# EAGLE design osbee_3.0 (EAGLE 9.6.2)
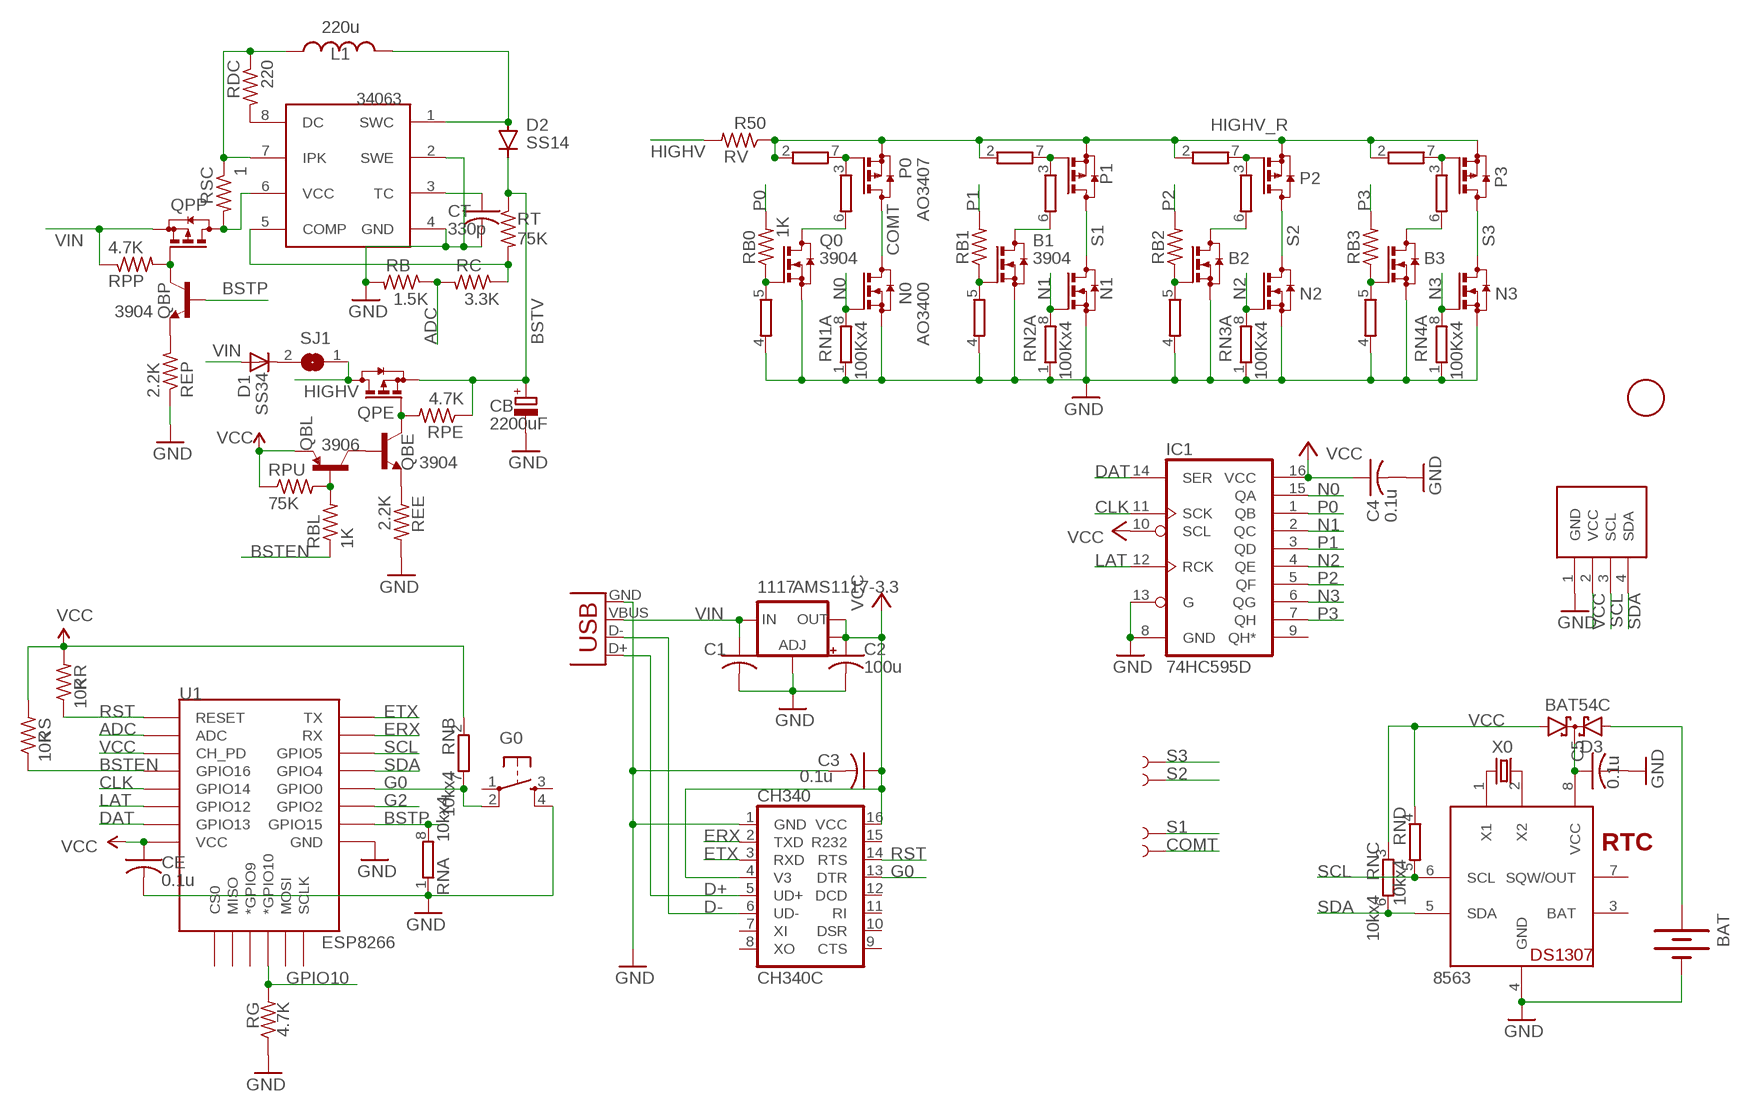
[diagram p0: schematic, sheet 1]

## Parts
1F  FIDUCIAL  [FIDUCIAL_1MM]
1117  AMS1117-3.3  V_REG_LM1117SOT223  [SOT223]
8563  PCF8563  DS1307SOIC  [SO08]
34063  MC34063  MC33063/MC34063D  [SO08]
B1  3904  BSS123  [SOT23]
B2  3904  BSS123  [SOT23]
B3  3904  BSS123  [SOT23]
BAT  BATTERYBATTERY_12MM_SMT  [BATTCON_12MM_SMT]
C1  10u  C-USC0805K  [C0805K]
C2  100u  CPOL-USC  [PANASONIC_C]
C3  0.1u  C-USC0603K  [C0603K]
C4  0.1u  C-USC0603  [C0603]
C5  0.1u  C-USC0603  [C0603]
CB  2200uF  CPOL-EUE5-8.5  [E5-8,5]
CE  0.1u  C-USC0603  [C0603]
CH340  CH340C  CH340G  [SO16]
CT  330p  C-USC0603K  [C0603K]
D1  SS34  DIODESMB  [SMB-DIODE]
D2  SS14  DIODE-DO-214AC  [DO-214AC]
D3  BAT54C  [SOT23]
G0  SPST_TACT  [EVQ-Q2-SMD]
IC1  74HC595D  74LS595D  [SO16]
L1  220u  INDUCTORCR54  [CR54]
N0  AO3400  BSS123  [SOT23]
N1  AO3400  BSS123  [SOT23]
N2  AO3400  BSS123  [SOT23]
N3  AO3400  BSS123  [SOT23]
P0  AO3407  BSS84  [SOT23]
P1  AO3407  BSS84  [SOT23]
P2  AO3407  BSS84  [SOT23]
P3  AO3407  BSS84  [SOT23]
Q0  3904  BSS123  [SOT23]
QBE  3904  TRANSISTOR_NPNSOT23-3  [SOT23-3]
QBL  3906  TRANSISTOR_PNPSMD  [SOT23-3]
QBP  3904  TRANSISTOR_NPNSOT23-3  [SOT23-3]
QPE  AO3407  BSS84  [SOT23]
QPP  AO3407  BSS84  [SOT23]
RB  1.5K  R-US_R0603  [R0603]
RB0  1K  R-US_R0603  [R0603]
RB1  1K  R-US_R0603  [R0603]
RB2  1K  R-US_R0603  [R0603]
RB3  1K  R-US_R0603  [R0603]
RBL  1K  R-US_R0603  [R0603]
RC  3.3K  R-US_R0603  [R0603]
RDC  220  R-US_R0603  [R0603]
REE  2.2K  R-US_R0603  [R0603]
REP  2.2K  R-US_R0603  [R0603]
RG  4.7K  R-US_R0603  [R0603]
RN  10kx4  4R-NEXB38V  [EXB38V]
RN1  100Kx4  4R-NEXB38V  [EXB38V]
RN2  100Kx4  4R-NEXB38V  [EXB38V]
RN3  100Kx4  4R-NEXB38V  [EXB38V]
RN4  100Kx4  4R-NEXB38V  [EXB38V]
RPE  4.7K  R-US_R0603  [R0603]
RPP  4.7K  R-US_R0603  [R0603]
RPU  75K  R-US_R0603  [R0603]
RR  10K  R-US_R0603  [R0603]
RS  10K  R-US_R0603  [R0603]
RSC  1  R-US_R0603  [R0603]
RT  75K  R-US_R0603  [R0603]
RV  R50  R-US_R2512  [R2512]
SJ1  SJ  [SJ]
ST1  NOBOM-  SEWTAP9X9  [PETAL-9X9]
ST2  NOBOM-  SEWTAP9X9  [PETAL-9X9]
ST3  NOBOM-  SEWTAP9X9  [PETAL-9X9]
STT  NOBOM-  SEWTAP9X9  [PETAL-9X9]
U1  ESP8266  ESP12ESMD  [ESP12E-SMD]
U$1  NOBOM-OLED  SSD1306_OLED_I2C0.75BNEW  [SSD1306_OLED_I2C_PCB_0.75_BNEW]
USB  USBMICROB2  [USB-MICROB2]
X0  32.768kHz  KX-327-NHT  [3.2X1.5]

## Nets
ADC: RB.1 RC.2 U1.ADC
BSTEN: RBL.1 RS.1 U1.GPIO16
BSTP: QBP.1(B) RN.8 U1.GPIO15
BSTV [relaypower]: CB.+ D2.C QPE.2(S) RPE.1 RT.1
CLK: IC1.11(SCK) U1.GPIO14
COMT [relaypower]: N0.3(D) P0.3(D) STT.P$1
D+: CH340.5(UD+) USB.D+
D-: CH340.6(UD-) USB.D-
DAT: IC1.14(SER) U1.GPIO13
ERX: CH340.2(TXD) U1.RXD0(RX)
ETX: CH340.3(RXD) U1.TXD0(TX)
G0: CH340.13(DTR) G0.2 RN.7 U1.GPIO0
G2: U1.GPIO2
GND: 1117.1(ADJ) 8563.4(GND) 34063.2(SWE) 34063.4(GND) B1.2(S) B2.2(S) B3.2(S) BAT.P$1(-) C1.2 C2.- C3.2 C4.2 C5.2 CB.- CE.2 CH340.1(GND) CT.2 G0.4 IC1.8(GND) IC1.13(G) N0.2(S) N1.2(S) N2.2(S) N3.2(S) Q0.2(S) RB.2 REE.2 REP.1 RG.1 RN1.1 RN1.4 RN2.1 RN2.4 RN3.1 RN3.4 RN4.1 RN4.4 RN.1 U1.GND U$1.1(GND) USB.GND
GPIO10: RG.2 U1.GPIO10(*GPIO10)
HIGHV [relaypower]: QPE.3(D) RV.2 SJ1.1
HIGHV_R [relaypower]: P0.2(S) P1.2(S) P2.2(S) P3.2(S) RN1.2 RN2.2 RN3.2 RN4.2 RV.1
LAT: IC1.12(RCK) U1.GPIO12
N0: IC1.15(QA) N0.1(G) RN1.8
N1: IC1.2(QC) N1.1(G) RN2.8
N2: IC1.4(QE) N2.1(G) RN3.8
N3: IC1.6(QG) N3.1(G) RN4.8
N$1: P0.1(G) RN1.3 RN1.7
N$2: QBP.3(C) QPP.1(G) RPP.2
N$3: Q0.3(D) RN1.6
N$4: B1.3(D) RN2.6
N$5: Q0.1(G) RB0.1 RN1.5
N$6: B3.1(G) RB3.1 RN4.5
N$7: P1.1(G) RN2.3 RN2.7
N$8: B3.3(D) RN4.6
N$9 [relaypower]: 34063.1(SWC) D2.A L1.P$2
N$10: D1.C SJ1.2
N$11: BAT.P$2(+) D3.2(A2)
N$12: P2.1(G) RN3.3 RN3.7
N$13: B2.3(D) RN3.6
N$14: 8563.1(X1) X0.1
N$15: QBL.1(B) RBL.2 RPU.2
N$16: P3.1(G) RN4.3 RN4.7
N$17: QBE.1(B) QBL.3(C)
N$21: QBE.2(E) REE.1
N$23: B1.1(G) RB1.1 RN2.5
N$24: B2.1(G) RB2.1 RN3.5
N$26 [relaypower]: 34063.7(IPK) L1.P$1 RDC.1 RSC.1
N$27: 34063.6(VCC) QPP.3(D) RSC.2
N$28: 34063.3(TC) CT.1
N$29: 34063.5(COMP) RC.1 RT.2
N$30: 8563.2(X2) X0.2
N$31: 34063.8(DC) RDC.2
N$32: QBP.2(E) REP.2
N$38: QBE.3(C) QPE.1(G) RPE.2
N$51: 8563.8(VCC) C5.1 D3.3(CC)
P0: IC1.1(QB) RB0.2
P1: IC1.3(QD) RB1.2
P2: IC1.5(QF) RB2.2
P3: IC1.7(QH) RB3.2
RST: CH340.14(RTS) RR.1 U1.RESET
S1 [relaypower]: N1.3(D) P1.3(D) ST1.P$1
S2 [relaypower]: N2.3(D) P2.3(D) ST2.P$1
S3 [relaypower]: N3.3(D) P3.3(D) ST3.P$1
SCL: 8563.6(SCL) RN.5 U1.GPIO5 U$1.3(SCL)
SDA: 8563.5(SDA) RN.6 U1.GPIO4 U$1.4(SDA)
VCC [power]: 1117.2(OUT) 1117.4(OUT) C2.+ C3.1 C4.1 CE.1 CH340.4(V3) CH340.16(VCC) D3.1(A1) IC1.10(SCL) IC1.16(VCC) QBL.2(E) RN.2 RN.3 RN.4 RPU.1 RR.2 RS.2 U1.CH_PD U1.VCC U$1.2(VCC)
VIN [power]: 1117.3(IN) C1.1 D1.A QPP.2(S) RPP.1 USB.VBUS
Unconnected: 8563.7(SQW/OUT) CH340.7(XI) CH340.8(XO) CH340.9(CTS) CH340.10(DSR) CH340.11(RI) CH340.12(DCD) CH340.15(R232) G0.1 G0.3 IC1.9(QH*) U1.CS0 U1.GPIO9(*GPIO9) U1.MISO U1.MOSI U1.SCLK

## Notes on the sheet
- RTC

## Power pins joined to a net without a drawn wire
BAT: 8563.3(BAT)

## Library data of the parts
1F = adafruitGood:FIDUCIAL: For use by pick and place machines to calibrate the vision/machine, 1mm By microbuilder.eu
1117 = SparkFun:V_REG_LM1117: Voltage Regulator LM1117 Standard adjustable voltage regulator but in SMD form. Spark Fun Electronics SKU : COM-00595
8563 = adafruit:DS1307: DS1307 Real time clock (RTC) with battery backup ability. Talk to it via i2c
34063 = adafruit:MC33063/MC34063: MC33063 and MC34063 Basic DC/DC converter with internal power-NPN transistor, 100KHz, 1.5A peak switch current. 3-40 input/output.
B1-B3 N0 N1-N3 Q0 = transistor-small-signal:BSS123: N-CHANNEL MOS FET
BAT = SparkFunNew:BATTERY: Battery Holders Various common sizes : AA, AAA, 20mm coin cell and 12mm coin cell.
C1 C3-C5 CE CT = adafruit:C-US: CAPACITOR, American symbol
C2 = adafruit_3:CPOL-US: POLARIZED CAPACITOR, American symbol
CB = rcl:CPOL-EU: POLARIZED CAPACITOR, European symbol; SPICEPREFIX: C
CH340 = SparkFunNew:CH340
D1 = SparkFunNew:DIODE: Diode These are standard reverse protection diodes and small signal diodes. SMA package can handle up to about 1A. SOD-323 can handle about 200mA. What the SOD-323 package when ordering, there are some mfgs out there that are 5-pin packages.
D2 = diode:DIODE-: DIODE
D3 = diode:BAT54C: Schottky Diodes Source: Fairchild .. BAT54.pdf
G0 = adafruit_3:SPST_TACT: SMT 6mm switch, EVQQ2 series http://www.ladyada.net/library/eagle
IC1 = SparkFun:74*595: 8-bit SHIFT REGISTER, output latch
L1 = SparkFunNew:INDUCTOR: Inductors Basic Inductor/Choke - 0603 and 1206. Footprints are not proven and vary greatly between part numbers.
P0 P1-P3 QPE QPP = transistor-small-signal:BSS84: P-CHANNEL MOS FET
QBE QBP = SparkFunNew:TRANSISTOR_NPN: Transistor NPN BJT configuration in SOT23 package. MMBT2222 is the common NPN we use. Double check BCE configuration again layout.
QBL = SparkFun:TRANSISTOR_PNP
RB RB0 RB1-RB3 RBL RC RDC REE REP RPE RPP RPU RSC RT = adafruitGood:R-US_: RESISTOR, American symbol
RG RV = adafruit2013:R-US_: RESISTOR, American symbol
RN RN1-RN4 = resistor-net:4R-N: Array Chip Resistor Source: RS Component / Phycomp; OC_FARNELL: unknown; OC_NEWARK: unknown
RR RS = adafruit:R-US_: RESISTOR, American symbol
SJ1 = jumper:SJ: SMD solder JUMPER
ST1-ST3 STT = LilyPad-Wearables:SEWTAP
U1 = esp8266modules:ESP12E: ESP12E Module
U$1 = adafruit2013:SSD1306_OLED_I2C
USB = SparkFunNew:USB: USB Connectors USB-B-PTH is fully proven SKU : PRT-00139 USB-miniB is fully proven SKU : PRT-00587 USB-A-PCB is untested. USB-A-H is throughly reviewed, but untested. Spark Fun Electronics SKU : PRT-00437 USB-B-SMT is throughly reviewed, but untested. Needs silkscreen touching up. USB-A-S has not been used/tested USB-MB-H has not been used/tested
X0 = crystal-geyer_V1_0:KX-327: Tuning Fork Crystals (kHz) SMD: KX327 - Serie Model Size l/w/h [mm] Frequency Range Frequency Stability Temp. Range [°C] Load Capacitance AECQ 200 availabel Datasheet KX-327VT KX-327FT KX-327RT KX-327NHT KX-327NHF KX-327L KX-327S 1.25/1.05/0.5 1.6/1.0/0.5 2.0/1.2/0.6 3.2/1.5/0.8 3.2/1.5/0.8 7.0/1.5/1.4 8.2/3.8/2.5 32,768 kHz 32,768 kHz 32,768 kHz 32,768 kHz 32,768 kHz 32,768 kHz 32,768 kHz ±10 … ±20ppm ±10 … ±20ppm ±10 … ±20ppm ±10 … ±20ppm ±10 … ±20ppm ±10 … ±20ppm ±5 … ±20ppm (*) -40°C …+85°C (*) -40°C …+85°C (*) -40°C …+85°C (*) -40°C …+85°C (*) -40°C …+125°C (*) -40°C …+85°C (*) -40°C …+85°C 7/9/12,5 7/9/12,5 7/9/12,6 7/9/12,5 9/12,5 7/9/12,5 6/12,5 - - - - yes - - KX-327VT.pdf <http://www.geyer-electronic.de/uploads/tx_userartikelfrequenz/GEYER-KX-327VT.pdf> KX-327FT.pdf <http://www.geyer-electronic.de/uploads/tx_userartikelfrequenz/GEYER-KX-327FT.pdf> KX-327RT.pdf <http://www.geyer-electronic.de/uploads/tx_userartikelfrequenz/GEYER-KX-327RT.pdf> KX-327NHT.pdf <http://www.geyer-electronic.de/uploads/tx_userartikelfrequenz/GEYER-KX-327NHT.pdf> KX-327NHF.pdf <http://www.geyer-electronic.de/uploads/tx_userartikelfrequenz/GEYER-KX-327NHF.pdf> KX-327L.pdf <http://www.geyer-electronic.de/uploads/tx_userartikelfrequenz/GEYER-KX-327L.pdf> KX-327S.pdf <http://www.geyer-electronic.de/uploads/tx_userartikelfrequenz/GEYER-KX-327S.pdf> <http://www.geyer-electronic.de/fileadmin/template/img/logo-geyer-electronic.png> Details see: http://www.geyer-electronic.de/Frequenz-Produkte.9.0.html Created 2016-06-07, Hans Locher 2016 (C) Geyer Quartz Technology KX327VT,KX327FT,KX327RT,KX327NHT,KX327NHF,KX327S,KX327L;125105;1610;2012;3215;7015;8238;1,25x1,05,1.25x1.05;1,6x1,0,1.6x1.0;2,0x1,2,2.0x1.2;3,2x1,5,3.2x1.5;8,2x3,8,8.2x3.8,7.0x1.5,7,0x1,532.768kHz

## Net classes
0 default: width 0.203 mm, clearance 0.178 mm
1 power: width 0.305 mm, clearance 0.178 mm
2 relaypower: width 0.406 mm, clearance 0.203 mm

## Board
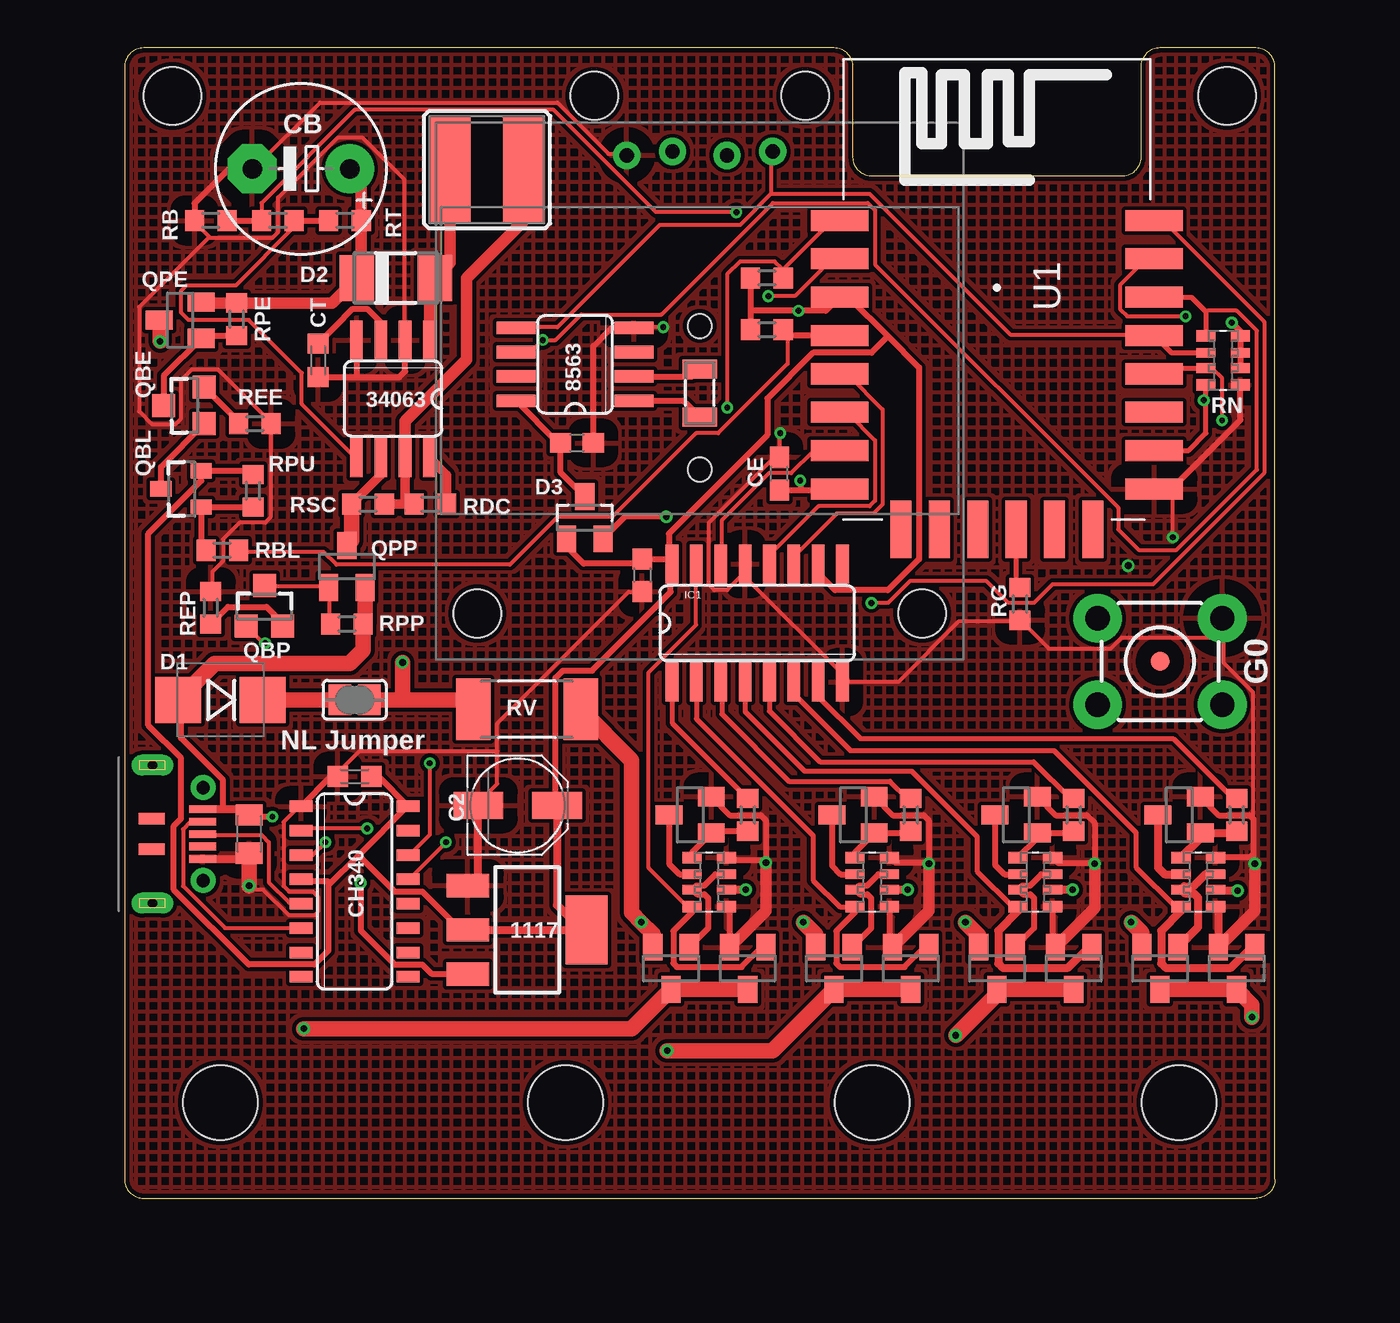
[diagram p1: board, top side]
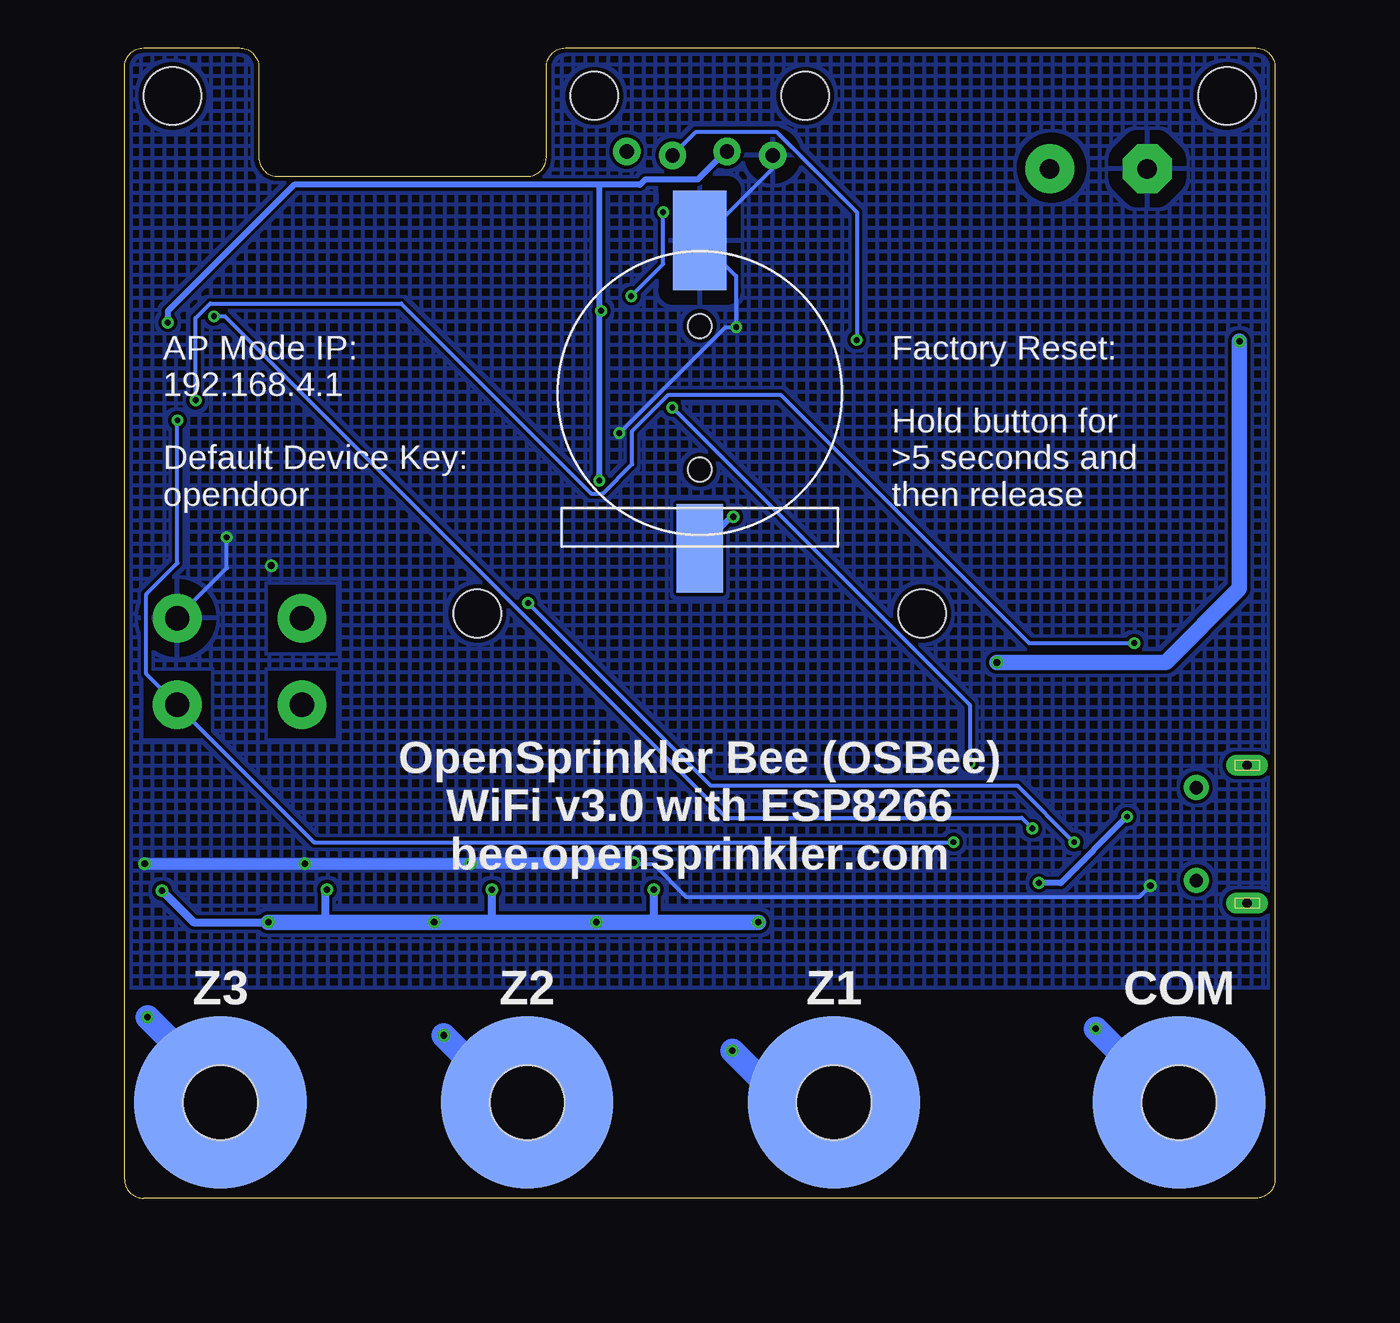
[diagram p2: board, bottom side, seen from below]

Size 60 x 60 mm. Coordinates in mm from the lower left corner, seen from the top.
Outline: 1,0 59,0 arc90 60,1 60,59 arc90 59,60 54,60 arc90 53,59 53,54.3 arc-90 52,53.3 39,53.3 arc-90 38,54.3 38,59 arc90 37,60 1,60 arc90 0,59 0,1 arc90 1,0
Copper layers (1*16): Top 0.035mm / dielectric 1.5mm / Bottom 0.035mm
Design rules "Fusion_eagle_rule_v1.1 *": minimum track width 6mil, minimum drill 12mil, track to track 6mil, track to pad 6mil, pad to pad 6mil, via to via 6mil, smd to smd 0mil, copper to edge 10mil, drill to drill 10mil, minimum pad ring 10mil, minimum via ring 6mil, stop-mask expansion 2mil, vias tented up to drill 100mil, thermal gap 30mil
Holes 3 mm at 2.5,57.5 57.5,57.5
Holes 3.9 mm at 5,5 23,5 39,5 55,5
bRestrict: area 9.8,51.9 to 13.5,55.6; area 49,28.5 to 52.5,32; area 49,24 to 52.5,27.5; area 55.5,24 to 59,27.5
vRestrict: area 39,36.5 to 52,52.5

### Footprints (pad centres in the part's own frame; a part is rotated, then mirrored left to right if it is on the bottom)
FIDUCIAL_1MM = smd 1 x 1: 1 0,0
SOT223 = smd 2.235 x 1.219: 1 3.099,-2.311; 2 3.099,0; 3 3.099,2.311 | smd 2.2 x 3.6: 4 -3.099,0
SO08 = smd 0.66 x 2.032: 1 -1.905,-3.073; 2 -0.635,-3.073; 3 0.635,-3.073; 4 1.905,-3.073; 5 1.905,3.073; 6 0.635,3.073; 7 -0.635,3.073; 8 -1.905,3.073
SOT23 = smd 1 x 1.4: 1 -0.95,-1.1; 2 0.95,-1.1; 3 0,1.1
BATTCON_12MM_SMT = smd 2.8 x 5.2: P$1 0,11.96 | smd 2.4 x 4.6: P$2 0,-4.1 | hole 1.25: 0,7.5; 0,0
C0805K = smd 1.1 x 1.4: 1 -1,0; 2 1,0
PANASONIC_C = smd 2.6 x 1.4: + 2.05,0; - -2.05,0
C0603K = smd 1.05 x 1.08: 1 -0.875,0; 2 0.875,0
C0603 = smd 1.1 x 1: 1 -0.85,0; 2 0.85,0
E5-8,5 = drill 1.016 pad 2.54: + -2.54,0 | drill 1.016 pad 2.54 octagon: - 2.54,0
SO16 = smd 0.6 x 1.2: 1 -4.445,-2.8; 2 -3.175,-2.8; 3 -1.905,-2.8; 4 -0.635,-2.8; 5 0.635,-2.8; 6 1.905,-2.8; 7 3.175,-2.8; 8 4.445,-2.8; 9 4.445,2.8; 10 3.175,2.8; 11 1.905,2.8; 12 0.635,2.8; 13 -0.635,2.8; 14 -1.905,2.8; 15 -3.175,2.8; 16 -4.445,2.8
SMB-DIODE = smd 2.4 x 2.4: A 2.2,0; C -2.2,0
DO-214AC = smd 1.8 x 2.4: A 2.025,0; C -2.025,0
EVQ-Q2-SMD = drill 1.27 pad 2.54: 1 -3.251,-2.261; 2 3.251,-2.261; 3 -3.251,2.261; 4 3.251,2.261
SO16' = smd 0.66 x 2.032: 1 -4.445,-3.073; 2 -3.175,-3.073; 3 -1.905,-3.073; 4 -0.635,-3.073; 5 0.635,-3.073; 6 1.905,-3.073; 7 3.175,-3.073; 8 4.445,-3.073; 9 4.445,3.073; 10 3.175,3.073; 11 1.905,3.073; 12 0.635,3.073; 13 -0.635,3.073; 14 -1.905,3.073; 15 -3.175,3.073; 16 -4.445,3.073
CR54 = smd 2.15 x 5.5: P$1 -1.92,0; P$2 1.92,0
SOT23-3 = smd 1.2 x 1.2: 1 1,-0.95; 2 1,0.95; 3 -1.1,0
SOT23-3' = smd 0.8 x 1.1: 1 -0.95,-1; 2 0.95,-1; 3 0,1.1
R0603 = smd 1 x 1.1: 1 -0.85,0; 2 0.85,0
EXB38V = smd 0.6 x 1: 1 -1.275,-0.9; 4 1.275,-0.9; 5 1.275,0.9; 8 -1.275,0.9 | smd 0.5 x 1: 2 -0.4,-0.9; 3 0.4,-0.9; 6 0.4,0.9; 7 -0.4,0.9
R2512 = smd 1.8 x 3.2: 1 -2.8,0; 2 2.8,0
SJ = smd 1.168 x 1.6: 1 -0.762,0; 2 0.762,0
PETAL-9X9 = smd 9 x 9: P$1 0,0
ESP12E-SMD = smd 1.1 x 3: ADC -1.5,-8.2; CH_PD 0.5,-8.2; GND 10.5,8.2; GPIO0 4.5,8.2; GPIO2 6.5,8.2; GPIO4 2.5,8.2; GPIO5 0.5,8.2; GPIO12 6.5,-8.2; GPIO13 8.5,-8.2; GPIO14 4.5,-8.2; GPIO15 8.5,8.2; GPIO16 2.5,-8.2; RESET -3.5,-8.2; RXD0 -1.5,8.2; TXD0 -3.5,8.2; VCC 10.5,-8.2 | smd 3 x 1.1: CS0 12.6,-5; GPIO9 12.6,-1; GPIO10 12.6,1; MISO 12.6,-3; MOSI 12.6,3; SCLK 12.6,5
SSD1306_OLED_I2C_PCB_0.75_BNEW = drill 0.75 pad 1.422: 1 -3.81,-0.1; 2 -1.42,0.1; 3 1.42,-0.1; 4 3.81,0.1 | hole 2.5: 11.6,-24; -11.6,-24; -5.5,3; 5.5,3
USB-MICROB2 = smd 1.4 x 0.4: D+ -1.375,0; D- -1.375,-0.65; GND -1.375,1.3; ID -1.375,0.65; VBUS -1.375,-1.3 | drill 0.5 pad 1.1 long: MT1 1.25,-3.6; MT2 1.25,3.6 | smd 1.35 x 0.6: MT3 1.275,0.8; MT4 1.275,-0.8 | drill 0.7 pad 1.3: MT5 -1.4,-2.425; MT6 -1.4,2.425
3.2X1.5 = smd 1 x 1.8: 1 -1.25,0; 2 1.25,0

### Placement (x,y rotation side)
1F  54,28 0 top
1117  21,14 180 top
8563  23.5,43.5 90 top
34063  14,41.7 180 top
B1  38,20 90 top
B2  46.5,20 90 top
B3  55,20 90 top
BAT  30,38 0 bottom
C1  6.5,19 270 top
C2  20.5,20.5 0 top
C3  12,22 180 top
C4  27,32.5 270 top
C5  23.6,39.4 0 top
CB  9.2,53.7 180 top
CE  34.15,37.8 90 top
CH340  12,16 270 top
CT  10.1,43.7 270 top
D1  5,26 180 top
D2  14.15,48 0 top
D3  24,35.5 0 top
G0  54,28 0 top
IC1  74HC595D  [SO16']  33,30 0 top
L1  18.9,53.65 180 top
N0  32.5,12 180 top
N1  41,12 180 top
N2  49.5,12 180 top
N3  58,12 180 top
P0  28.5,12 180 top
P1  37,12 180 top
P2  45.5,12 180 top
P3  54,12 180 top
Q0  29.5,20 90 top
QBE  3.15,41.35 0 top
QBL  3906  [SOT23-3']  3,37 90 top
QBP  7.3,30.85 270 top
QPE  2.9,45.8 90 top
QPP  11.6,32.95 0 top
RB  4.5,51 180 top
RB0  32.5,20 90 top
RB1  41,20 90 top
RB2  49.5,20 90 top
RB3  58,20 90 top
RBL  5.1,33.8 180 top
RC  8,51 180 top
RDC  15.95,36.2 0 top
REE  6.8,40.4 0 top
REP  4.5,30.8 270 top
RG  46.7,31 90 top
RN  57.3,43.7 90 top
RN1  30.5,16.5 90 top
RN2  39,16.5 90 top
RN3  47.5,16.5 90 top
RN4  56,16.5 90 top
RPE  5.85,45.85 270 top
RPP  11.6,29.95 180 top
RPU  6.7,36.9 270 top
RR  33.5,48 180 top
RS  33.5,45.3 180 top
RSC  12.7,36.2 180 top
RT  11.5,51 180 top
RV  21,25.5 180 top
SJ1  12,26 180 top
ST1  23,5 0 bottom
ST2  39,5 0 bottom
ST3  55,5 0 bottom
STT  5,5 0 bottom
U1  45.5,47.5 270 top
U$1  30,54.5 0 top
USB  2.7,19 180 top
X0  30,42 90 top

### Tracks (layer width: path | path; a pad name or v marks a point on that pad's centre or on a via)
ADC  (via drill 0.3)
  Top 0.203: v31.91,51.44 27.72,51.44 22.38,56.77 12,56.77 7.14,51.91 7.14,51.15 RC.2 | v33.58,47.06 34.96,47.06 36.86,48.96 37.24,48.96 U1.ADC
  Top 0.305: RB.1 RC.2
  Bottom 0.203: v31.91,51.44 31.91,48.73 v33.58,47.06
BSTEN
  Top 0.203: RBL.1 6,33.72 10.38,33.72 11.05,33.05 20.1,33.05 22.57,35.53 25.43,35.53 29.81,39.91 30.96,39.91 34.58,43.53 34.58,44.86 RS.1
  Top 0.305: U1.GPIO16 34.65,45 RS.1
BSTP  (via drill 0.3)
  Top 0.203: v7.33,28.96 7.24,28.96 6.38,29.81 QBP.1 | v56.29,41.62 56.4,41.62
  Top 0.254: U1.GPIO15 55.5,39 56.4,39.9 56.4,41.62 RN.8
  Bottom 0.203: v7.33,28.96 12.82,28.96 25.78,41.91 31.62,41.91 33.53,40.01 33.53,38.29 35.05,36.77 35.66,36.77 45.56,46.67 55.53,46.67 56.29,45.91 v56.29,41.62
BSTV
  Top 0.61: CB.+ 12.35,53.09 RT.1 12.35,48.23 D2.C 10.82,46.7 RPE.1 4.05,46.7 QPE.2
CLK
  Top 0.203: IC1.11 34.96,33.15 34.96,33.53 37.15,35.72 39.05,35.72 39.53,36.2 39.53,41.15 37.72,42.96 37.34,42.96 U1.GPIO14
COMT  (via drill 0.35)
  Top 0.813: N0.3 P0.3 26.45,8.85 v9.35,8.85
  Bottom 1.27: STT.P$1 5.5,5 v9.35,8.85
D+
  Top 0.203: CH340.5 9.14,15.43 8.57,15.43 7.53,16.48 7.53,18.57 7.14,18.95 4.1,18.95 USB.D+
D-
  Top 0.203: CH340.6 9.14,14.1 5.24,14.1 3.05,16.29 3.05,19.24 3.43,19.62 4,19.62 USB.D-
DAT
  Top 0.203: IC1.14 31.15,33.15 31.15,35.34 33.62,37.81 34.77,37.81 35.91,38.96 37.24,38.96 U1.GPIO13
ERX  (via drill 0.3)
  Top 0.203: v12.65,19.29 9.27,19.29 CH340.2 | v55.34,46.01 52.29,46.01 51.91,46.39 51.91,47.62 53.24,48.96 53.63,48.96 U1.RXD0
  Bottom 0.203: v12.65,19.29 13.2,19.84 28.6,19.84 54.77,46.01 v55.34,46.01
ETX  (via drill 0.3)
  Top 0.203: v10.48,18.57 9.81,17.91 9.24,17.91 CH340.3 | v38.96,31.05 39.81,31.05 40.96,32.19 44.96,32.19 46.1,31.05 47.44,31.05 48.42,32.03 53.65,32.03 59.44,37.81 59.44,45.72 54.2,50.96 53.72,50.96 U1.TXD0
  Bottom 0.203: v10.48,18.57 13.43,21.53 29.43,21.53 v38.96,31.05
G0  (via drill 0.3)
  Top 0.203: v16.76,18.57 14.86,16.67 CH340.13 | v57.24,40.58 57.24,42.77 56.77,43.24 56.48,43.24 RN.7
  Top 0.254: U1.GPIO0 54,43.3 RN.7
  Bottom 0.203: v16.76,18.57 50.1,18.57 57.24,25.72 G0.2 57.34,25.81 58.86,27.34 58.86,31.51 57.24,33.13 v57.24,40.58
GND  (via drill 0.3, 0.35)
  Top 0.203: v28.1,45.43 26.67,45.43 8563.4 | REP.1 4.57,31.72 4.57,32.67 5.14,33.24 5.14,34.38 6,35.24 7.33,35.24 7.62,35.53 7.62,40.39 REE.2 7.62,40.48 4.86,43.24 3.52,43.24 2.95,42.67 2.95,40.67 2.67,40.39 1.43,40.39 0.76,41.05 0.76,46.48 4.38,50.1 4.48,50.1 | 4.48,50.1 7.71,50.1 8,50.39 8,52.2 11.14,55.34 12.38,55.34 14.57,53.15 14.57,44.86 34063.2 | 4.48,50.1 3.71,50.86 RB.2 | U$1.1 26.1,54.48 25.24,54.48 22.57,57.15 10.19,57.15 6.76,53.72 CB.- | 19.43,23.31 19.43,21.62 18.48,20.67 C2.- | 19.43,23.31 19.43,24.77 26.29,31.62 26.96,31.62 C4.2 | C3.2 11.12,22.2 12.24,23.31 19.43,23.31 | v6.5,16.3 6.86,16.1 7.24,16.1 8.57,14.76 9.91,14.76 10.1,14.95 10.1,15.72 9.81,16 8.57,16 8.29,16.29 8.29,19.62 9.05,20.38 CH340.1 | 58.76,19.9 58.86,20 58.86,26.38 57.34,27.91 57.34,30.19 G0.4 57.24,29.24 52.01,29.24 51.44,28.67 48.2,28.67 46.77,30.1 RG.1 46.67,30.1 43.53,30.1 40.39,26.96 37.53,26.96 IC1.8 37.72,27.05 32.29,32.48 IC1.13 32.29,33.05 32.29,32.58 31.43,31.72 30.77,31.72 30.48,32 30.48,35.24 33.81,38.58 34.1,38.58 CE.2 34.2,38.67 v34.2,39.91 | v54.67,34.48 54.67,36.86 U1.GND
  Top 0.305: U1.GND 54.6,37 58.2,40.6 RN.1 | CB.- 5.45,53.7 3.65,51.9 RB.2 | CT.2 12.1,42.83 | 12.1,42.83 14.32,42.83 14.63,43.13 34063.2 | 34063.4 12.1,42.83 | CH340.1 10.76,22 C3.2 | C5.2 24.45,44.45 25.41,45.41 8563.4 | RN1.1 31.55,15.07 N0.2 | RN2.1 39.9,13.25 N1.2 | RN3.1 48.4,13.25 N2.2 | 58.88,17.96 58.88,19.79 58.76,19.9 58.69,19.98 57.07,19.98 B3.2 | 58.88,17.96 58.69,17.77 RN4.4 | v58.95,17.45 58.88,17.52 58.88,17.96 | Q0.2 31.57,19.98 33.19,19.98 33.45,19.72 33.45,17.65 | 33.45,17.65 v33.45,17.5 | RN1.4 31.52,17.65 33.45,17.65 | B1.2 40.07,19.98 41.69,19.98 41.95,19.72 v41.95,17.45 41.88,17.52 40.16,17.52 RN2.4 | B2.2 48.57,19.98 50.19,19.98 50.6,19.57 50.6,17.5 | 50.6,17.5 v50.6,17.45 | RN3.4 48.67,17.5 50.6,17.5
  Top 0.406: USB.GND 6.2,17.7 C1.2 | 1117.1 18.45,16.86 C2.- | RN4.1 57.05,15.07 N3.2
  Top 0.61: N0.2 33.45,15 v33.45,17.5 | N1.2 41.95,15 v41.95,17.45 | N2.2 50.6,15.15 v50.6,17.45 | N3.2 58.95,15 v58.95,17.45
  Top 0.813: C1.2 v6.5,16.3
  Bottom 0.203: U$1.1 26.19,54.39 26.19,53.72 29.91,50.01 BAT.P$1 29.91,49.91 28.1,48.1 v28.1,45.43 28.67,45.43 v34.2,39.91 | v54.67,34.48 54.67,32.86 57.24,30.29 G0.4 | v6.5,16.3 7.07,15.73 30.72,15.73 32.42,17.43 33.15,17.43 v33.45,17.5
  Bottom 0.61: v33.45,17.5 41.9,17.5 v41.95,17.45 v50.6,17.45 v58.95,17.45
  other vias: 52.35,33
  pour Top (isolate 0.2, hatched): 0,60 60,60 60,0 0,0
  pour Bottom (hatched): 0,60 60,60 60,11 0,11
GPIO10
  Top 0.254: U1.GPIO10 46.5,32.05 RG.2
HIGHV  (via drill 0.35)
  Top 0.813: SJ1.1 14.55,26 | 14.55,26 17.7,26 RV.2 | QPE.3 1.85,45.75 v1.85,44.7 | v14.5,27.95 14.5,26.05 14.55,26
  Bottom 0.813: v1.85,44.7 1.85,31.8 5.7,27.95 v14.5,27.95
HIGHV_R  (via drill 0.35)
  Top 0.406: RN2.2 v40.85,16.1 | RN3.2 v49.45,16.1 | RN4.2 56.95,16.05 v58.05,16.05 | RN1.2 v32.4,16.1
  Top 0.813: P0.2 27.55,13.8 v26.95,14.4 26.45,14.9 26.45,22.85 RV.1 | v35.4,14.4 36.05,13.75 P1.2 | v43.85,14.4 44.55,13.7 P2.2 | v52.5,14.4 53.05,13.85 P3.2
  Bottom 0.406: v40.85,16.1 40.85,14.4 | v49.45,16.1 49.55,16 49.55,14.4 | v58.05,16.05 56.4,14.4 v52.5,14.4 | v32.4,16.1 32.4,14.4
  Bottom 0.813: v26.95,14.4 32.4,14.4 v35.4,14.4 40.85,14.4 v43.85,14.4 49.55,14.4 v52.5,14.4
LAT
  Top 0.203: IC1.12 33.72,33.15 33.72,33.62 36.2,36.1 38.86,36.1 39.15,36.39 39.15,39.53 37.72,40.96 37.34,40.96 U1.GPIO12
N0
  Top 0.203: IC1.15 29.81,33.05 29.81,29.91 27.34,27.43 27.34,17.24 29.24,15.34 29.53,15.34 RN1.8
  Top 0.305: N0.1 33.22,13.1 32.19,12.07 28.81,12.07 28.62,12.26 28.62,13.94 29.6,14.92 RN1.8
N1
  Top 0.254: IC1.2 29.82,25.01 35.91,18.92 35.91,16.59 37.3,15.2 38.08,15.2 RN2.8
  Top 0.305: N1.1 41.72,13.1 40.69,12.07 37.31,12.07 37.12,12.26 37.12,13.94 38.1,14.92 RN2.8
N2
  Top 0.254: IC1.4 32.37,25.39 35.46,22.29 41.04,22.29 44.46,18.87 44.46,17.06 46.29,15.22 RN3.8
  Top 0.406: N2.1 50.29,13.1 49.21,12.02 45.79,12.02 45.57,12.24 45.57,13.96 46.6,14.99 RN3.8
N3
  Top 0.254: IC1.6 34.91,26.3 37.85,23.35 48.48,23.35 52.76,19.07 52.76,17.26 54.79,15.22 RN4.8
  Top 0.406: N3.1 58.79,13.1 57.71,12.02 54.29,12.02 54.07,12.24 54.07,13.96 55.1,14.99 RN4.8
N$1
  Top 0.305: P0.1 30.43,14.08 30.43,15.66 30.24,15.86 29.84,15.86 RN1.7 29.82,16.32 30.24,16.32 30.82,16.9 RN1.3
N$2
  Top 0.203: RPP.2 10.67,30 10.67,31.81 QPP.1 10.57,31.91 7.33,31.91 QBP.3
N$3
  Top 0.305: Q0.3 28.4,17.45 28.95,16.9 RN1.6
N$4
  Top 0.305: B1.3 36.9,17.35 37.35,16.9 RN2.6
N$5
  Top 0.305: RN1.5 29.6,18.05 Q0.1 30.7,19.15 RB0.1
N$6
  Top 0.406: RB3.1 57.9,19.05 B3.1 56.1,18.77 RN4.5
N$7
  Top 0.305: RN2.3 39.32,16.9 38.74,16.32 38.32,16.32 RN2.7 38.34,15.86 38.74,15.86 38.93,15.66 38.93,14.08 P1.1
N$8
  Top 0.406: B3.3 53.9,17.25 54.25,16.9 RN4.6
N$9
  Top 0.61: L1.P$2 16.98,48.8 D2.A 15.9,47.73 34063.1
N$10
  Top 0.813: D1.C SJ1.2
N$11  (via drill 0.35)
  Top 0.305: v28.25,35.55 26.1,35.55 D3.2
  Bottom 0.305: BAT.P$2 28.35,35.55 v28.25,35.55
N$12
  Top 0.305: RN3.3 47.82,16.9 47.24,16.32 46.82,16.32 RN3.7 46.84,15.86 47.24,15.86 47.43,15.66 47.43,14.08 P2.1
N$13
  Top 0.305: B2.3 45.4,17.4 45.9,16.9 RN3.6
N$14
  Top 0.305: 8563.1 29.16,41.59 X0.1
N$15
  Top 0.305: RPU.2 QBL.1 4,34.05 RBL.2
N$16
  Top 0.406: RN4.3 56.38,16.9 55.98,16.51 55.98,16.49 55.76,16.27 55.27,16.27 RN4.7 55.29,15.91 55.76,15.91 55.98,15.68 55.98,14.13 P3.1
N$17
  Top 0.305: QBL.3 1.9,38.15 QBE.1
N$21
  Top 0.305: QBE.2 5.95,40.5 REE.1
N$23
  Top 0.305: RN2.5 38.1,18.05 B1.1 40.9,19.05 RB1.1
N$24
  Top 0.305: RN3.5 47.6,18.77 B2.1 49.4,19.05 RB2.1
N$26
  Top 0.508: RSC.1 14.9,36.2 | 14.9,36.2 RDC.1 | 34063.7 14.63,36.47 14.9,36.2
  Top 0.61: 34063.7 14.63,40.53 17.83,43.73 17.83,47.98 20.82,50.97 L1.P$1
N$27
  Top 0.508: RSC.2 13.37,37.72 34063.6
  Top 0.813: QPP.3 11.85,34.3 RSC.2
N$28
  Top 0.305: CT.1 11.44,45.91 11.44,45.93 11.91,46.4 12.65,46.4 13.45,45.6 13.45,44.86 34063.3
N$29
  Top 0.203: RC.1 8.86,50.86 8.86,50.67 5.81,47.62 3.24,47.62 2.95,47.34 2.95,46.2 3.33,45.81 6.48,45.81 9.24,43.05 9.24,41.43 12,38.67 34063.5
  Top 0.305: RC.1 RT.2
N$30
  Top 0.305: 8563.2 29.61,42.87 X0.2
N$31
  Top 0.508: 34063.8 16.8,37.73 RDC.2
N$32
  Top 0.305: REP.2 5.4,30.85 7.4,30.85 8.25,30 QBP.2
N$38
  Top 0.305: RPE.2 4.15,45 QPE.1 2.05,42.9 QBE.3
N$51
  Top 0.305: D3.3 22.75,37.85 C5.1 22.62,39.4 8563.8
P0
  Top 0.254: IC1.1 28.55,24.8 RB0.2
P1
  Top 0.254: IC1.3 31.15,26.87 31.15,25.25 34.65,21.75 39.93,21.75 40.83,20.85 RB1.2
P2
  Top 0.254: IC1.5 33.63,25.41 36.28,22.77 47.41,22.77 49.33,20.85 RB2.2
P3
  Top 0.254: IC1.7 36.17,26.18 38.37,23.98 54.7,23.98 57.83,20.85 RB3.2
RST  (via drill 0.3)
  Top 0.203: U1.RESET 37.24,50.96 36.86,50.96 34.38,48.48 34.38,48.01 RR.1 34.29,48.48 33.91,48.86 32.1,48.86 31.43,48.2 v31.43,41.24 | v15.92,22.69 15.92,18.96 14.86,17.91 CH340.14
  Bottom 0.203: v15.92,22.69 15.92,25.73 v31.43,41.24
S1  (via drill 0.35)
  Top 0.813: N1.3 P1.3 33.8,7.7 v28.3,7.7
  Bottom 1.27: ST1.P$1 25.6,5 v28.3,7.7
S2  (via drill 0.35)
  Top 0.813: N2.3 P2.3 45.5,10.65 v43.35,8.5
  Bottom 1.27: ST2.P$1 39.85,5 v43.35,8.5
S3  (via drill 0.35)
  Top 0.813: P3.3 N3.3 58.8,10.1 v58.8,9.45
  Bottom 1.27: ST3.P$1 55,5.65 v58.8,9.45
SCL  (via drill 0.3)
  Top 0.203: 8563.6 20.48,44.2 21.24,44.2 v21.81,44.77 22.48,44.77 23.81,46.1 28,46.1 33.81,51.91 38.77,51.91 39.15,51.53 39.15,48.7 51.83,36.02 51.83,34.88 52.9,33.81 54.86,33.81 59.05,38.01 59.05,45.24 58.01,46.29 56.48,46.29 56.4,46.25
  Top 0.254: U1.GPIO5 55.65,47 56.4,46.25 RN.5
  Bottom 0.203: v21.81,44.77 21.81,51.44 26,55.63 30.19,55.63 31.34,54.48 U$1.3
SDA
  Top 0.203: 33.72,52.39 32.1,50.77 27.91,50.77 22.57,45.43 20.48,45.43 8563.5 | 33.72,52.39 33.72,54.58 U$1.4 | 33.72,52.39 38.86,52.39 46.2,45.05 53.63,45.05 U1.GPIO4
  Top 0.254: U1.GPIO4 54.6,44.1 RN.6
VCC  (via drill 0.3)
  Top 0.305: RN.2 RN.3 RN.4 58.2,45.22 v57.74,45.67 | C3.1 13.24,22 CH340.16 14.77,20.46 12.21,17.89 | IC1.16 28.28,33.35 C4.1 26.75,33.1 23.95,33.1 23.05,34 D3.1 | RR.2 32.65,46.29 | 32.65,46.29 RS.2 | CE.1 35.24,36.95 | 35.24,36.95 37.25,36.95 U1.VCC | RPU.1 6.5,37.95 QBL.2 4,37.81 4,37.43 1.24,34.67 1.24,24.67 2.95,22.95 2.95,19.81 2.57,19.43 2.57,16.1 6.48,12.19 9.91,12.19 10.62,12.91 10.62,16.31 | IC1.16 28.48,32.96 28.48,31.62 24.38,27.53 22.86,27.53 22.48,27.15 22.48,20.67 C2.+ | CH340.4 9.32,16.52 10.62,16.52 10.62,16.31 | 12.21,17.89 10.62,16.31 | 12.21,17.89 14.1,16 15.53,16 17.43,14.1 17.72,14.1 1117.2 | 32.65,46.29 v35.15,46.29 36.58,46.29 37.24,46.96 U1.CH_PD 37.43,46.96 37.81,46.96 39.81,44.96 | 39.81,44.96 41.43,43.34 41.43,33.34 39.81,31.72 37.05,31.72 36.2,32.58 36.2,33.05 IC1.10 | v35.24,37.43 35.24,36.95 | 39.81,44.96 38.96,44.1 35.91,44.1 33.53,41.72 33.53,39.81 28.38,34.67 28.38,33.43 IC1.16
  Top 0.406: 1117.2 23.85,14 | 23.85,14 1117.4 | C2.+ 22.55,15.3 23.85,14
  Bottom 0.305: v57.74,45.67 57.74,46.27 51.16,52.86 35.24,52.86 | 35.24,52.86 33.13,52.86 32.85,53.14 30.11,53.14 28.67,54.58 U$1.2 | 35.24,52.86 35.24,46.29 | 35.24,46.29 v35.24,37.43 | v35.15,46.29 35.24,46.29
VIN  (via drill 0.3)
  Top 0.305: v12.32,16.45 12.32,13.97 14.1,12.19 15.53,12.19 16,11.72 17.81,11.72 1117.3 | v7.71,19.91 6.67,19.91 C1.1 | 5.14,20.3 5.14,21.81 2.95,24 2.95,25.62 D1.A
  Top 0.406: USB.VBUS 5.14,20.3 6.2,20.3 C1.1
  Top 0.813: QPP.2 12.55,30.05 RPP.1 12.45,28.6 11.75,27.9 4.7,27.9 D1.A
  Bottom 0.305: v12.32,16.45 11.17,16.45 v7.71,19.91

### Text on the board
bPlace: COM | Z1 | Z2 | Z3
tNames: NL Jumper
bNames: Factory Reset: / / Hold button for / >5 seconds and / then release | AP Mode IP: / 192.168.4.1 / / Default Device Key: / opendoor | OpenSprinkler Bee (OSBee) / WiFi v3.0 with ESP8266 / bee.opensprinkler.com